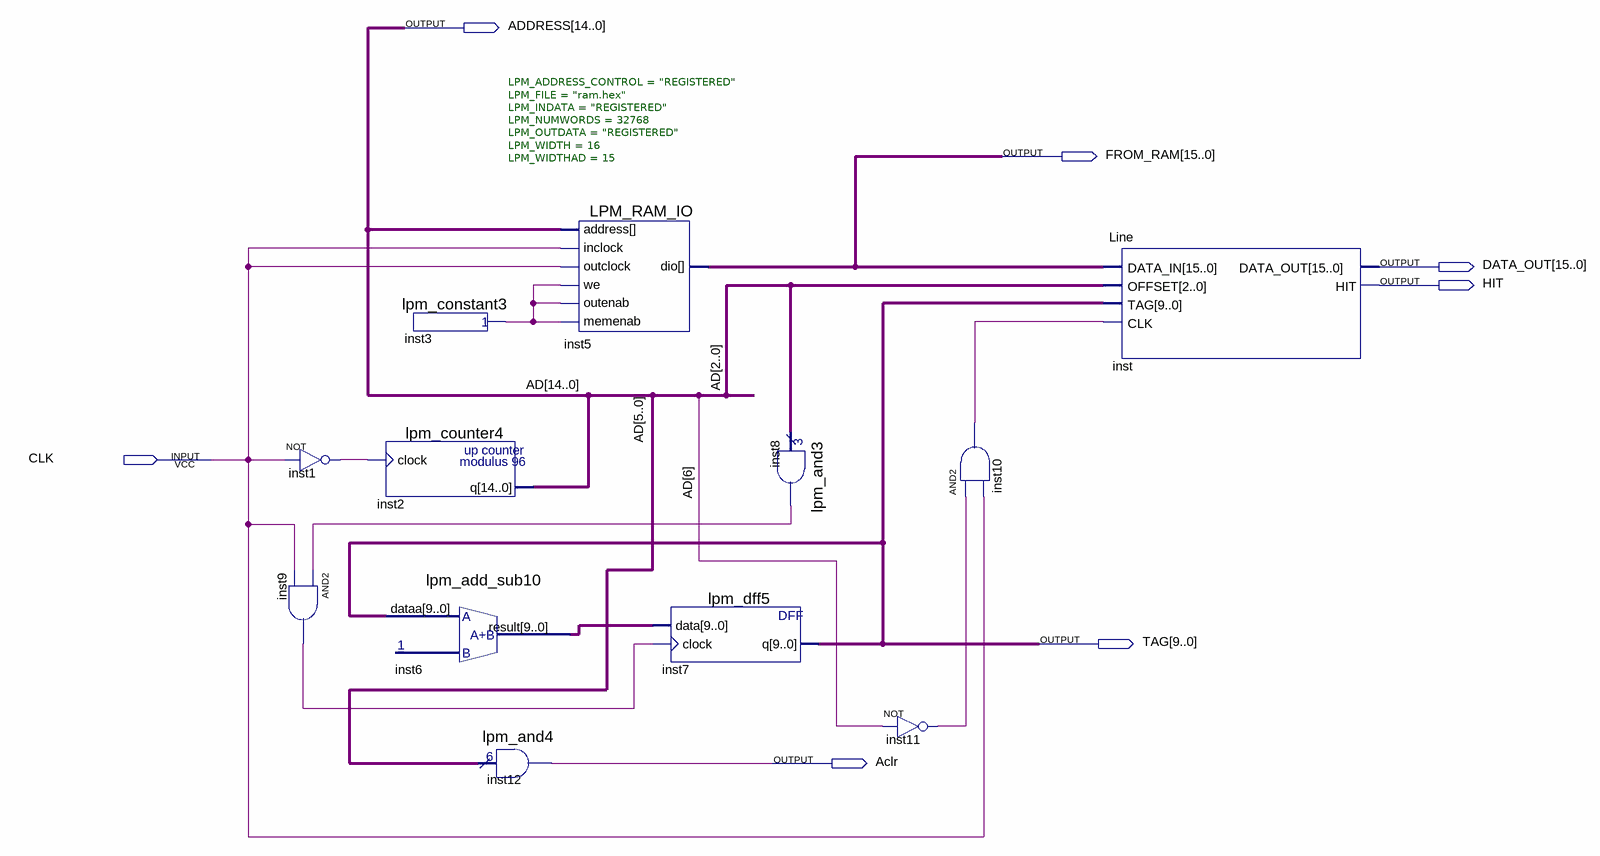
[diagram p0: schematic sheet]
// Quartus schematic Linetest.bdf as structural Verilog: 12 symbols, 7 pins
module Linetest (
  input  CLK,
  output [14:0] ADDRESS,
  output [15:0] FROM_RAM,
  output [15:0] DATA_OUT,
  output HIT,
  output [9:0] TAG,
  output Aclr
);

  wire inst1_out, inst3_result, inst8_result, inst9_out, inst10_out, inst11_out;
  wire [9:0] inst6_result;

  not inst1 (inst1_out, CLK);
  and inst9 (inst9_out, inst8_result, CLK);
  lpm_constant3 inst3 (.result(inst3_result));
  lpm_counter4 inst2 (.clock(inst1_out), .q(ADDRESS));
  lpm_add_sub10 inst6 (.dataa(TAG), .result(inst6_result));
  lpm_and4 inst12 (.data(ADDRESS[5:0]), .result(Aclr));
  LPM_RAM_IO #(.LPM_ADDRESS_CONTROL("REGISTERED"), .LPM_FILE("ram.hex"), .LPM_INDATA("REGISTERED"), .LPM_NUMWORDS(32768), .LPM_OUTDATA("REGISTERED"), .LPM_WIDTH(16), .LPM_WIDTHAD(15)) inst5 (
    .address(ADDRESS), .outclock(CLK), .memenab(inst3_result), .inclock(CLK), .we(inst3_result),
    .outenab(inst3_result), .dio(FROM_RAM));
  lpm_dff5 inst7 (.data(inst6_result), .clock(inst9_out), .q(TAG));
  lpm_and3 inst8 (.data(ADDRESS[2:0]), .result(inst8_result));
  not inst11 (inst11_out, ADDRESS[6]);
  and inst10 (inst10_out, inst11_out, CLK);
  Line inst (.DATA_IN(FROM_RAM), .OFFSET(ADDRESS[2:0]), .TAG(TAG), .CLK(inst10_out), .DATA_OUT(DATA_OUT), .HIT(HIT));

  // Other names for the same wires on the sheet: AD[14:0] = ADDRESS
endmodule
